# Altium schematic sheet MCU.SchDoc
size A4; Organization: Altium Limited; Address1: L3, 12a Rodborough Rd; Address2: Frenchs Forest; Address3: NSW; Address4: Australia 2086
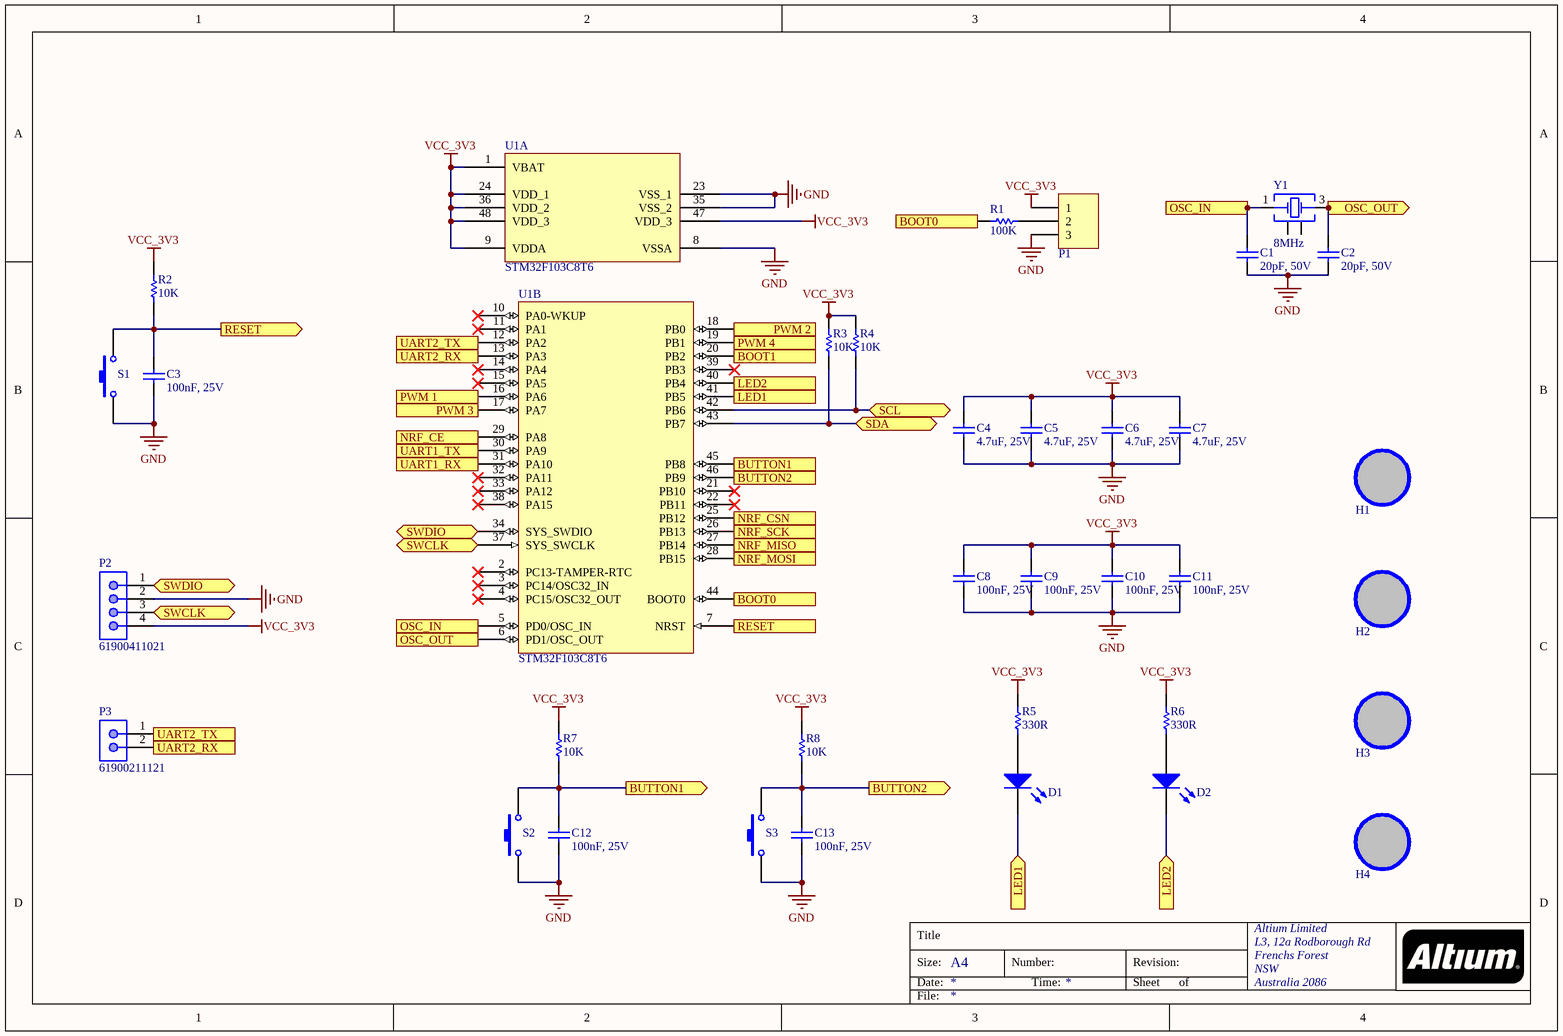
[diagram p0: MCU.SchDoc]

## Parts
C1  value 20pF, 50V  [CAP-SM-0805]  (hidden comment: Cap Non-Pol SMD)
C2  value 20pF, 50V  [CAP-SM-0805]  (hidden comment: Cap Non-Pol SMD)
C3  value 100nF, 25V  [CAP-SM-0805]  (hidden comment: Cap Non-Pol SMD)
C4  value 4.7uF, 25V  [CAP-SM-0805]  (hidden comment: Cap Non-Pol SMD)
C5  value 4.7uF, 25V  [CAP-SM-0805]  (hidden comment: Cap Non-Pol SMD)
C6  value 4.7uF, 25V  [CAP-SM-0805]  (hidden comment: Cap Non-Pol SMD)
C7  value 4.7uF, 25V  [CAP-SM-0805]  (hidden comment: Cap Non-Pol SMD)
C8  value 100nF, 25V  [CAP-SM-0805]  (hidden comment: Cap Non-Pol SMD)
C9  value 100nF, 25V  [CAP-SM-0805]  (hidden comment: Cap Non-Pol SMD)
C10  value 100nF, 25V  [CAP-SM-0805]  (hidden comment: Cap Non-Pol SMD)
C11  value 100nF, 25V  [CAP-SM-0805]  (hidden comment: Cap Non-Pol SMD)
C12  value 100nF, 25V  [CAP-SM-0805]  (hidden comment: Cap Non-Pol SMD)
C13  value 100nF, 25V  [CAP-SM-0805]  (hidden comment: Cap Non-Pol SMD)
D1  LED SMD  [LED_0603_Blue]  (value not drawn)
D2  LED SMD  [LED_0603_Blue]  (value not drawn)
H1  Hole  [LO KHOAN 3MM]  (value not drawn)
H2  Hole  [LO KHOAN 3MM]  (value not drawn)
H3  Hole  [LO KHOAN 3MM]  (value not drawn)
H4  Hole  [LO KHOAN 3MM]  (value not drawn)
P1  Header 3  [JP3]  (value not drawn)
P2  61900411021  [61900411021]
P3  61900211121  [61900211121]
R1  value 100K  [RES-SM-0805]  (hidden comment: RESISTOR SMD)
R2  value 10K  [RES-SM-0805]  (hidden comment: RESISTOR SMD)
R3  value 10K  [RES-SM-0805]  (hidden comment: RESISTOR SMD)
R4  value 10K  [RES-SM-0805]  (hidden comment: RESISTOR SMD)
R5  value 330R  [RES-SM-0805]  (hidden comment: RESISTOR SMD)
R6  value 330R  [RES-SM-0805]  (hidden comment: RESISTOR SMD)
R7  value 10K  [RES-SM-0805]  (hidden comment: RESISTOR SMD)
R8  value 10K  [RES-SM-0805]  (hidden comment: RESISTOR SMD)
S1  Tact SW - 2Pin  [SW-SMD]  (value not drawn)
S2  Tact SW - 2Pin  [SW-SMD]  (value not drawn)
S3  Tact SW - 2Pin  [SW-SMD]  (value not drawn)
U1  STM32F103C8T6  [LQFP48]  (parts A,B of 2)
Y1  8MHz  [WE-XTAL_CFPX-104]

## Ports
BOOT0 (in), BOOT0 (out), BOOT1 (in), BUTTON1 (in), BUTTON1 (out), BUTTON2 (in), BUTTON2 (out), LED1 (in), LED1 (out), LED2 (in), LED2 (out), NRF_CE (out), NRF_CSN (out), NRF_MISO (in), NRF_MOSI (out), NRF_SCK (out), OSC_IN (in), OSC_IN (out), OSC_OUT (in), OSC_OUT (out), PWM 1 (out), PWM 2 (out), PWM 3 (out), PWM 4 (out), RESET (in), RESET (out), SCL (bidir), SDA (bidir), SWCLK (bidir), SWDIO (bidir), UART1_RX (in), UART1_TX (out), UART2_RX (in), UART2_RX (out), UART2_TX (in), UART2_TX (out)

## Nets
GND: C1.1 C2.1 C3.1 C4.1 C5.1 C6.1 C7.1 C8.1 C9.1 C10.1 C11.1 C12.1 C13.1 P1.3 P2.2 S1.1 S2.1 S3.1 U1.8(VSSA) U1.23(VSS_1) U1.35(VSS_2)
VCC_3V3: C4.2 C5.2 C6.2 C7.2 C8.2 C9.2 C10.2 C11.2 P1.1 P2.4 R2.1 R3.1 R4.1 R5.2 R6.2 R7.1 R8.1 U1.1(VBAT) U1.9(VDDA) U1.24(VDD_1) U1.36(VDD_2) U1.47(VDD_3) U1.48(VDD_3)
BOOT0: R1.1 U1.44(BOOT0) ; port BOOT0
BOOT1: U1.20(PB2) ; port BOOT1
BUTTON1: C12.2 R7.2 S2.2 U1.45(PB8) ; port BUTTON1
BUTTON2: C13.2 R8.2 S3.2 U1.46(PB9) ; port BUTTON2
LED1: D1.2(K) U1.41(PB5) ; port LED1
LED2: D2.2(K) U1.40(PB4) ; port LED2
NRF_CE: U1.29(PA8) ; port NRF_CE
NRF_CSN: U1.25(PB12) ; port NRF_CSN
NRF_MISO: U1.27(PB14) ; port NRF_MISO
NRF_MOSI: U1.28(PB15) ; port NRF_MOSI
NRF_SCK: U1.26(PB13) ; port NRF_SCK
OSC_IN: C1.2 U1.5(PD0/OSC_IN) Y1.1(OSC1) ; port OSC_IN
OSC_OUT: C2.2 U1.6(PD1/OSC_OUT) Y1.3(OSC2) ; port OSC_OUT
PWM 1: U1.16(PA6) ; port PWM 1
PWM 2: U1.18(PB0) ; port PWM 2
PWM 3: U1.17(PA7) ; port PWM 3
PWM 4: U1.19(PB1) ; port PWM 4
RESET: C3.2 R2.2 S1.2 U1.7(NRST) ; port RESET
SCL: R4.2 U1.42(PB6) ; port SCL
SDA: R3.2 U1.43(PB7) ; port SDA
SWCLK: P2.3 U1.37(SYS_SWCLK) ; port SWCLK
SWDIO: P2.1 U1.34(SYS_SWDIO) ; port SWDIO
UART1_RX: U1.31(PA10) ; port UART1_RX
UART1_TX: U1.30(PA9) ; port UART1_TX
UART2_RX: P3.2 U1.13(PA3) ; port UART2_RX
UART2_TX: P3.1 U1.12(PA2) ; port UART2_TX
NetD1_1: D1.1(A) R5.1
NetD2_1: D2.1(A) R6.1
NetP1_2: P1.2 R1.2

Not connected (* = marked no-connect by the designer): H1 1; H2 1; H3 1; H4 1; U1 2(PC13-TAMPER-RTC)* 3(PC14/OSC32_IN)* 4(PC15/OSC32_OUT)* 10(PA0-WKUP)* 11(PA1)* 14(PA4)* 15(PA5)* 21(PB10)* 22(PB11)* 32(PA11)* 33(PA12)* 38(PA15)* 39(PB3)*; Y1 2(GND) 4(GND)

## Notes on the sheet
- Title
- Size:
- Date:
- A4
- Number:
- Time:
- Revision:
- Sheet
- of
- File:

## Library data of the parts
C1-C13 = Cap Non-Pol SMD: Capacitor
D1 D2 = LED SMD: LED
H1-H4 = Hole: Hole 3mm
P1 = Header 3: Header, 3-Pin; LatestRevisionDate: 17-Jul-2002; LatestRevisionNote: Re-released for DXP Platform.; Publisher: Altium Limited
P2 = 61900411021: WR-WTB THT Male Left Angled Bottom Locking Header, pitch 2.54mm, 4p; Pin Number: 4; Contact Resistance: 20mOhm; Rated Current: 3A; Withstanding Voltage: 1000VAC; Working Voltage: 250VAC; ComponentLink1Description: Manufacturer; ComponentLink1URL: http://www.we-online.de; ComponentLink2Description: Datasheet; ComponentLink2URL: https://www.we-online.com/catalog/datasheet/61900411021.pdf; Pitch: 2.54mm; Published Date: January 2020; Publisher: Wurth Elektronik; Mounting Technology: THT; Packaging: Bag; Operating Temperature: -40 to +105degC; Part Number: 61900411021; Gender: Male; Type: Right Angled Bottom Locking
P3 = 61900211121: WR-WTB THT Male Vertical Locking Header, pitch 2.54mm, 2p; Pin Number: 2; Contact Resistance: 20mOhm; Rated Current: 3A; Withstanding Voltage: 1000VAC; Working Voltage: 250VAC; ComponentLink1Description: Manufacturer; ComponentLink1URL: http://www.we-online.de; ComponentLink2Description: Datasheet; ComponentLink2URL: https://www.we-online.com/catalog/datasheet/61900211121.pdf; Pitch: 2.54mm; Published Date: January 2020; Publisher: Wurth Elektronik; Mounting Technology: THT; Packaging: Bag; Operating Temperature: -40 to +105degC; Part Number: 61900211121; Gender: Male; Type: Vertical
R1-R8 = RESISTOR SMD: Resistor
S1-S3 = Tact SW - 2Pin: Switch button 2 pin
U1 = STM32F103C8T6: ARM Microcontrollers - MCU 32BIT Cortex M3 64KB 20KB RAM 2X12 ADC; Manufacturer: STMicroelectronics; Core: ARM Cortex M3; ADC Resolution: 12 bit; Maximum Clock Frequency: 72 MHz; Number of I/Os: 37 I/O; Supply Voltage - Min: 2 V; Supply Voltage - Max: 3.6 V; Interface Type: CAN, I2C, SPI, USART, USB; Data RAM Type: SRAM; Number of ADC Channels: 10 Channel; Number of Timers/Counters: 3 Timer; Processor Series: ARM Cortex M; Product Category: ARM Microcontrollers - MCU; Series: STM32F103C8; Mounting Style: SMD/SMT; Package / Case: LQFP-48; Program Memory Size: 64 kB; Data Bus Width: 32 bit; Data RAM Size: 20 kB; Minimum Operating Temperature: - 40 C; Maximum Operating Temperature: + 85 C; Length: 7 mm; ComponentLink1Description: Datasheet; ComponentLink1URL: https://www.mouser.vn/datasheet/2/389/stm32f103c8-1851025.pdf
Y1 = 830106162701: WE-XTAL Quartz Crystal, SMT, CFPX-104, 8MHz, +/-20ppm; Manufacturer: Wurth Elektronik; Frequency Stability: +/-30ppm; Load Capacitance: 16pF; ComponentLink1Description: Manufacturer; ComponentLink1URL: http://www.we-online.de; ComponentLink2Description: Datasheet; ComponentLink2URL: https://www.we-online.com/catalog/datasheet/830106162701.pdf; Operating Temperature: -40 to +85degC; Packaging: Tape and Reel; Manufacturer Part Number: 830106162701; Published Date: November 2020; Size: CFPX-104; Frequency: 8MHz; Frequency Tolerance: +/-20ppm; Mounting Technology: SMT